# EAGLE design Bridge Digitizer (EAGLE 6.0)
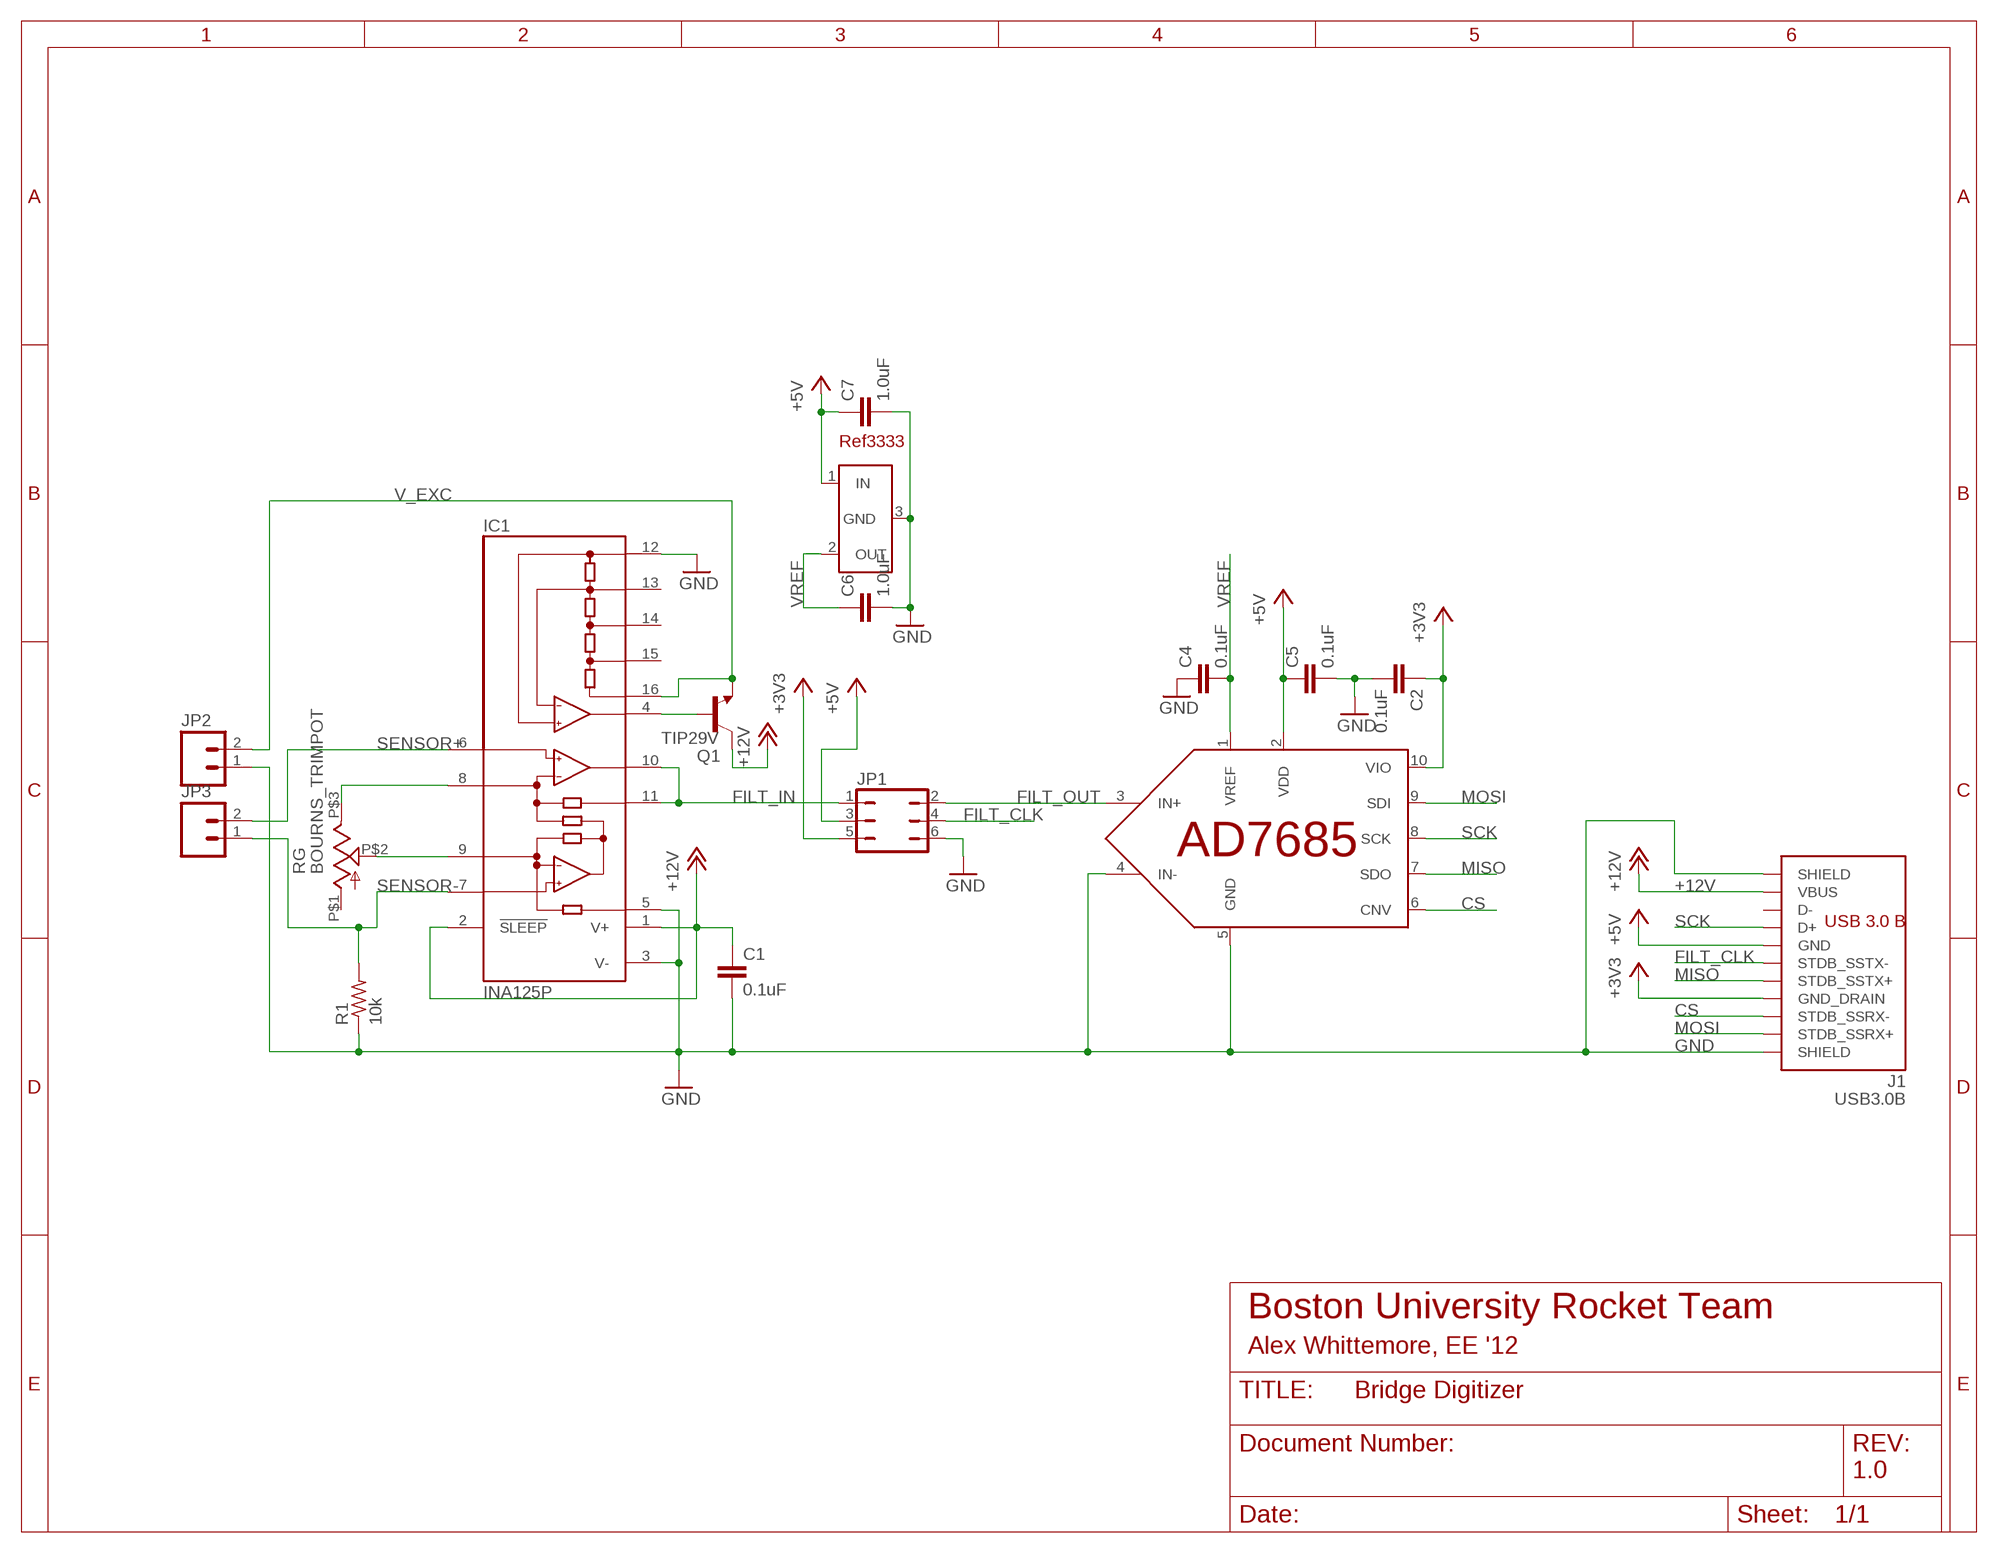
[diagram p0: schematic, sheet 1]

## Parts
C1  0.1uF  CAP0402-CAP  [0402-CAP]
C2  0.1uF  CAP0402-CAP  [0402-CAP]
C4  0.1uF  CAP0402-CAP  [0402-CAP]
C5  0.1uF  CAP0402-CAP  [0402-CAP]
C6  1.0uF  CAP0402-CAP  [0402-CAP]
C7  1.0uF  CAP0402-CAP  [0402-CAP]
IC1  INA125P  [DIL16]
IC3  AD7685  [MSOP10]
IC4  REF3333  [SOT23]
J1  USB3.0B  [AMPHENOLUSB3.0B]
JP1  JP3Q  [JP3Q]
JP2  M025MM  [SCREWTERMINAL-5MM-2]
JP3  M025MM  [SCREWTERMINAL-5MM-2]
Q1  TIP29V  [TO220V]
R1  10k  R-US_0207/7  [0207/7]
RG  BOURNS_TRIMPOT  [3296W]

## Nets
+3V3: C2.1 IC3.10(VIO) J1.7(GND_DRAIN) JP1.5
+5V: C5.1 C7.1 IC3.2(VDD) IC4.1(IN) J1.4(GND) JP1.3
+12V: C1.1 IC1.1(V+) IC1.2(!SLEEP) J1.1(VBUS) Q1.2(C)
CS: IC3.6(CNV) J1.8(STDB_SSRX-)
FILT_CLK: J1.5(STDB_SSTX-) JP1.4
FILT_IN: IC1.10(OUT) IC1.11(SENSE) JP1.1
FILT_OUT: IC3.3(IN+) JP1.2
GND: C1.2 C2.2 C4.1 C5.2 C6.2 C7.2 IC1.3(V-) IC1.5(REF) IC1.12(REFCOM) IC3.4(IN-) IC3.5(GND) IC4.3(GND) J1.10@1(SHIELD) J1.10@2(SHIELD) JP1.6 JP2.1 R1.1
MISO: IC3.7(SDO) J1.6(STDB_SSTX+)
MOSI: IC3.9(SDI) J1.9(STDB_SSRX+)
N$1: IC1.4(REFOUT) Q1.1(B)
N$2: IC1.9(RG) RG.P$2
N$3: IC1.8(RG) RG.P$3
SCK: IC3.8(SCK) J1.3(D+)
SENSOR+: IC1.6(+IN) JP3.2
SENSOR-: IC1.7(-IN) JP3.1 R1.2
V_EXC: IC1.16(REF10) JP2.2 Q1.3(E)
VREF: C4.2 C6.1 IC3.1(VREF) IC4.2(OUT)
Unconnected: IC1.13(REFBG) IC1.14(REF2.5) IC1.15(REF5) J1.2(D-) RG.P$1

## Notes on the sheet
- Boston University Rocket Team
- Alex Whittemore, EE '12
- 1.0

## Library data of the parts
C1 C2 C4-C7 = SparkFun:CAP: Capacitor Standard 0603 ceramic capacitor, and 0.1" leaded capacitor.
IC1 = burr-brown:INA125: Instrumentation Amplifier with Precision Voltage Reference; MF: TEXAS INSTRUMENT CONNECTORS; MPN: INA125P; OC_FARNELL: 1459461; OC_NEWARK: 35C1726
IC3 = AlexsParts:AD7685: AD7685 Analog Devices analog-to-digital converter
IC4 = AlexsParts:REF3333: REF3333 Texas Instruments/Burr Brown precision 3.3v voltage reference
J1 = AlexsParts:USB3.0B: USB3.0B Amphenol USB 3.0 B connector
JP1 = jumper:JP3Q: JUMPER
JP2 JP3 = SparkFun:M02: Header 2 Standard 2-pin 0.1" header. Use with straight break away headers (SKU : PRT-00116), right angle break away headers (PRT-00553), swiss pins (PRT-00743), machine pins (PRT-00117), and female headers (PRT-00115). Molex polarized connector foot print use with SKU : PRT-08233 with associated crimp pins and housings.
Q1 = transistor-npn:TIP29*: NPN Transistor
R1 = resistor:R-US_: RESISTOR, American symbol
RG = AlexsParts:BOURNS_TRIMPOT: Bourns 25-turn trimpot potentiometer

## Board
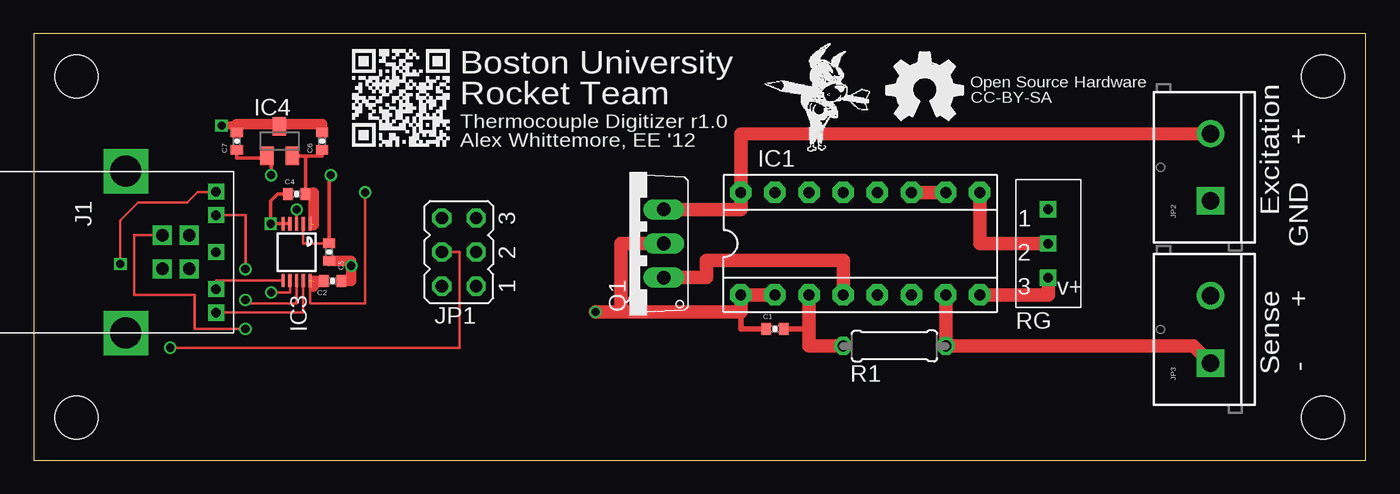
[diagram p1: board, top side]
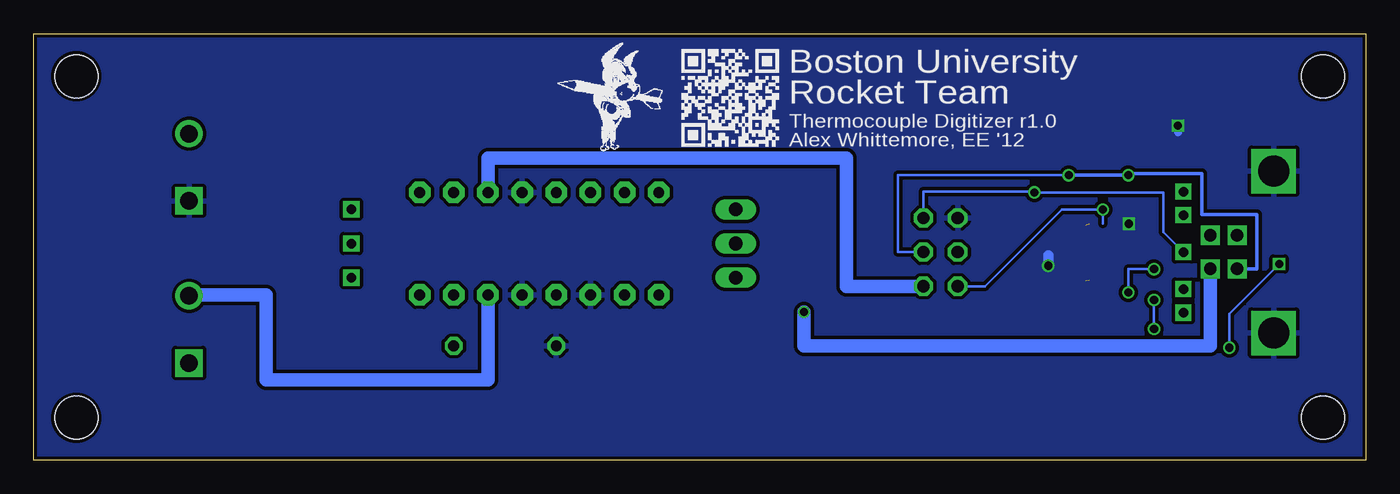
[diagram p2: board, bottom side, seen from below]

Size 99.06 x 31.75 mm. Coordinates in mm from the lower left corner, seen from the top.
Outline: 0,0 99.06,0 99.06,31.75 0,31.75 0,0
Copper layers (1*16): Top 0.035mm / dielectric 1.5mm / Bottom 0.035mm
Design rules: minimum track width 6mil, minimum drill 12mil, track to track 8mil, track to pad 8mil, pad to pad 8mil, via to via 8mil, smd to smd 0mil, copper to edge 10mil, drill to drill 10mil, minimum pad ring 10mil, minimum via ring 6mil, stop-mask expansion 2mil, vias tented up to drill 100mil, thermal gap 10mil
Holes 3.2 mm at 3.17,3.17 3.17,28.57 95.89,28.57 95.89,3.17

### Footprints (pad centres in the part's own frame; a part is rotated, then mirrored left to right if it is on the bottom)
0402-CAP = smd 0.7 x 0.9: 1 -0.65,0; 2 0.65,0
DIL16 = drill 0.813 pad 1.6 octagon: 1 -8.89,-3.81; 2 -6.35,-3.81; 3 -3.81,-3.81; 4 -1.27,-3.81; 5 1.27,-3.81; 6 3.81,-3.81; 7 6.35,-3.81; 8 8.89,-3.81; 9 8.89,3.81; 10 6.35,3.81; 11 3.81,3.81; 12 1.27,3.81; 13 -1.27,3.81; 14 -3.81,3.81; 15 -6.35,3.81; 16 -8.89,3.81
MSOP10 = smd 0.25 x 1: 1 -1,-2.113; 2 -0.5,-2.113; 3 0,-2.113; 4 0.5,-2.113; 5 1,-2.113; 6 1,2.113; 7 0.5,2.113; 8 0,2.113; 9 -0.5,2.113; 10 -1,2.113
SOT23 = smd 1 x 1.4: 1 -0.95,-1.1; 2 0.95,-1.1; 3 0,1.1
AMPHENOLUSB3.0B = drill 0.92 square: 1 1.25,4.71; 2 -1.25,4.71; 3 -1.25,2.71; 4 1.25,2.71 | drill 0.7 square: 5 -4.5,6.71; 6 -2.75,6.71; 7 0,6.71; 8 2.75,6.71; 9 4.5,6.71 | drill 2.3 square: 10@1 -6.02,0; 10@2 6.02,0
JP3Q = drill 0.914 octagon: 1 -2.54,-1.27; 2 -2.54,1.27; 3 0,-1.27; 4 0,1.27; 5 2.54,-1.27; 6 2.54,1.27
SCREWTERMINAL-5MM-2 = drill 1.3 pad 2.032 square: 1 0,0 | drill 1.3 pad 2.032: 2 5,0
TO220V = drill 1.016 long: 1 -2.54,-2.54; 2 0,-2.54; 3 2.54,-2.54
0207/7 = drill 0.813 octagon: 1 -3.81,0; 2 3.81,0
3296W = drill 0.7 square: P$1 0,0; P$2 0,2.54; P$3 0,5.08

### Placement (x,y rotation side)
C1  55.12,9.78 0 top
C2  22.23,13.34 0 top
C4  19.56,19.81 0 top
C5  21.97,15.49 270 top
C6  21.46,23.75 90 top
C7  15.11,23.75 90 top
IC1  61.47,16.13 0 top
IC3  19.56,15.49 180 top
IC4  18.29,23.75 0 top
J1  6.86,15.49 270 top
JP1  31.62,15.49 90 top
JP2  87.5,19.3 90 top
JP3  87.5,7.24 90 top
Q1  44.32,16.13 90 top
R1  64.01,8.51 0 top
RG  75.44,18.67 180 top
U$1  [OSHW_FILLX200_NOTEXT]  63.42,25.3 0 top

### Tracks (layer width: path | path; a pad name or v marks a point on that pad's centre or on a via)
+3V3  (via drill 0.6)  (1 unrouted)
  Top 0.203: v24.64,19.94 24.64,11.68 20.56,11.68 IC3.10
  Top 0.762: C2.1 20.83,13.34 20.83,12.95
  Bottom 0.203: JP1.5 32.89,19.99 24.64,19.99 v24.64,19.94 24.61,19.91 15.06,19.91 15.06,16.99 J1.7
+5V  (via drill 0.6)
  Top 0.203: C5.1 20.06,16.14 IC3.2
  Top 0.254: C7.1 15.11,22.48 17.02,22.48 17.02,22.65 IC4.1 17.65,22.65 v17.65,21.21 | v22.1,21.21 21.97,21.21 C5.1
  Bottom 0.203: JP1.3 34.8,15.49 34.8,21.21 v22.1,21.21
  Bottom 0.254: v22.1,21.21 v17.65,21.21 17.65,21.34 12.19,21.34 12.19,18.29 8.13,18.29 8.13,14.24 J1.4
+12V  (via drill 0.6)
  Top 0.406: C1.1 52.58,9.78 52.58,11.68
  Top 1.016: IC1.2 IC1.1 52.58,11.68 52.58,11.05 43.69,11.05 | Q1.2 43.69,16.13 43.69,11.05 | v41.78,11.05 43.69,11.05
  Bottom 1.016: J1.1 11.58,14.24 11.58,8.51 41.78,8.51 v41.78,11.05
CS
  Top 0.203: IC3.6 13.57,13.38 J1.8
FILT_CLK  (via drill 0.6)
  Top 0.203: v10.16,8.38 31.67,8.38 31.67,15.49 JP1.4 | v6.45,14.61 6.45,17.86 7.77,19.18 11.4,19.18 12.19,19.96 13.54,19.96 J1.5
  Bottom 0.203: v10.16,8.38 10.16,10.9 v6.45,14.61
FILT_IN
  Top 1.016: IC1.11 IC1.10
  Bottom 1.016: IC1.11 65.28,22.48 38.61,22.48 38.61,12.95 JP1.1
FILT_OUT  (via drill 0.6)
  Top 0.203: IC3.3 v19.56,18.67
  Bottom 0.203: IC3.3 v19.56,18.67 22.61,18.67 28.32,12.95 JP1.2
GND  (via drill 0.6)
  Top 0.254: IC3.4 IC3.5 v17.63,17.61 v17.63,17.6 17.63,19.28 18.16,19.81 C4.1
  Top 0.406: C1.2 57.66,9.78
  Top 0.61: 18.29,24.89 v13.97,24.89
  Top 0.762: C6.2 21.46,25.02 18.29,25.02 | C7.2 15.11,25.02 18.29,25.02 | 18.29,25.02 18.29,24.89 | C2.2 23.62,13.34 v23.62,14.48 23.62,14.84 C5.2
  Top 1.016: R1.1 57.66,8.51 57.66,9.78 IC1.3 | 18.29,24.89 IC4.3
  Bottom 0.254: v17.63,17.6 17.32,17.6
  Bottom 0.61: v13.97,24.89 13.97,24.38
  Bottom 0.762: v23.62,14.48 23.62,15.24
  pour Bottom (isolate 0.254): 0,31.75 99.06,31.75 99.06,0 0,0
MISO  (via drill 0.6)
  Top 0.203: J1.6 15.75,18.24 v15.75,14.22 | v17.65,12.5 19.06,12.5 IC3.7
  Bottom 0.203: v15.75,14.22 17.65,14.22 v17.65,12.5
MOSI
  Top 0.203: J1.9 20.06,10.99 IC3.9
N$1
  Top 1.016: Q1.1 50.04,13.59 50.04,14.86 60.2,14.86 IC1.4
N$2
  Top 1.016: RG.P$2 70.36,16.13 IC1.9
N$3
  Top 1.016: IC1.8 75.44,12.32 RG.P$3
SCK  (via drill 0.6)
  Top 0.203: IC3.8 19.56,11.68 15.75,11.68 v15.75,11.94 | v15.75,9.78 11.96,9.78 11.96,12.32 7.49,12.32 7.49,16.76 9.57,16.76 J1.3
  Bottom 0.203: v15.75,9.78 v15.75,11.94
SENSOR+
  Bottom 1.016: IC1.6 65.28,5.97 81.79,5.97 81.79,12.32 87.5,12.32 JP3.2
SENSOR-
  Top 1.016: IC1.7 R1.2 86.23,8.51 JP3.1
V_EXC
  Top 1.016: Q1.3 52.58,18.67 IC1.16 52.58,24.28 JP2.2
VREF  (1 unrouted)
  Top 0.254: C6.1 21.46,22.65 IC4.2 20.21,22.65 C4.2
  Top 0.762: C4.2 20.83,19.94 20.83,17.53

### Text on the board
tValues: GND | +3v3 | FILT_CK | +5 | FILT_IN | FILT_OUT
_tsilk: Boston University | Open Source Hardware | Excitation | CC-BY-SA | Rocket Team | Thermocouple Digitizer r1.0 | + | Alex Whittemore, EE '12 | GND | Sense | + | -
_bsilk: Boston University | Rocket Team | Thermocouple Digitizer r1.0 | Alex Whittemore, EE '12